# EAGLE design lpc134x (EAGLE 6.4)
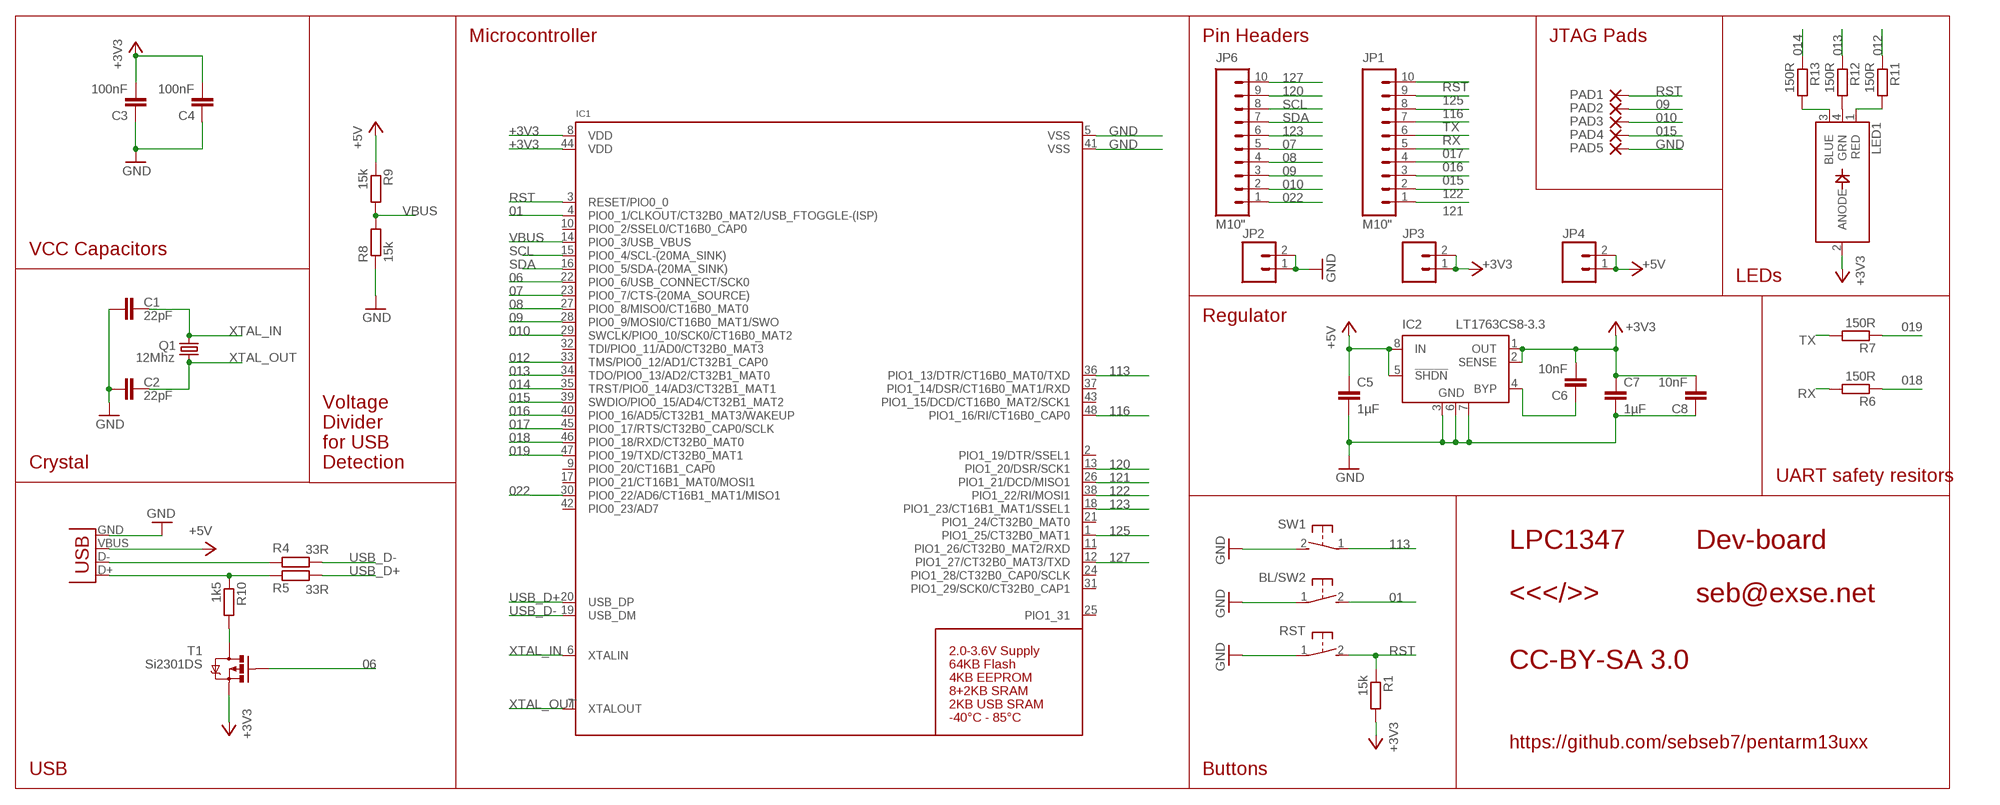
[diagram p0: schematic, sheet 1]

## Parts
BL/SW2  SWITCH_MCTAEF  [SWITCH_MCTAEF]
C1  22pF  C-EUC0402  [C0402]
C2  22pF  C-EUC0402  [C0402]
C3  100nF  C-EUC0402  [C0402]
C4  100nF  C-EUC0402  [C0402]
C5  1µF  CAP0805  [0805]
C6  10nF  C-EUC0402  [C0402]
C7  1µF  CAP0805  [0805]
C8  10nF  C-EUC0402  [C0402]
IC1  LPC1347_QFP48  [LQFP48]
IC2  LT1763CS8-3.3  [SOIC8]
JP1  M10"  [1X10]
JP2  M02PTH  [1X02]
JP3  M02PTH  [1X02]
JP4  M02PTH  [1X02]
JP6  M10"  [1X10]
LED1  LED_RGB_PLCC4  [RGBLED_PLCC4]
PAD1  WIREPADSMD1,27-254  [SMD1,27-2,54]
PAD2  WIREPADSMD1,27-254  [SMD1,27-2,54]
PAD3  WIREPADSMD1,27-254  [SMD1,27-2,54]
PAD4  WIREPADSMD1,27-254  [SMD1,27-2,54]
PAD5  WIREPADSMD1,27-254  [SMD1,27-2,54]
Q1  12Mhz  MT-OSCILLATOR  [MT]
R1  15k  R-EU_R0402  [R0402]
R4  33R  R-EU_R0402  [R0402]
R5  33R  R-EU_R0402  [R0402]
R6  150R  R-EU_R0402  [R0402]
R7  150R  R-EU_R0402  [R0402]
R8  15k  R-EU_R0402  [R0402]
R9  15k  R-EU_R0402  [R0402]
R10  1k5  R-EU_R0402  [R0402]
R11  150R  R-EU_R0402  [R0402]
R12  150R  R-EU_R0402  [R0402]
R13  150R  R-EU_R0402  [R0402]
RST  SWITCH_MCTAEF  [SWITCH_MCTAEF]
SW1  SWITCH_MCTAEF  [SWITCH_MCTAEF]
T1  Si2301DS  MOSFET-PCHANNEL  [SOT23]
X2  USB-SMD-NS  [USB-MINIB-NOSTOP]

## Nets
01: BL/SW2.2 IC1.4(PIO0_1/CLKOUT/CT32B0_MAT2/USB_FTOGGLE-(ISP))
06: IC1.22(PIO0_6/USB_CONNECT/SCK0) T1.1(G)
07: IC1.23(PIO0_7/CTS-(20MA_SOURCE)) JP6.5
08: IC1.27(PIO0_8/MISO0/CT16B0_MAT0) JP6.4
09: IC1.28(PIO0_9/MOSI0/CT16B0_MAT1/SWO) JP6.3 PAD2.1(P)
010: IC1.29(SWCLK/PIO0_10/SCK0/CT16B0_MAT2) JP6.2 PAD3.1(P)
012: IC1.33(TMS/PIO0_12/AD1/CT32B1_CAP0) R11.1
013: IC1.34(TDO/PIO0_13/AD2/CT32B1_MAT0) R12.1
014: IC1.35(TRST/PIO0_14/AD3/CT32B1_MAT1) R13.1
015: IC1.39(SWDIO/PIO0_15/AD4/CT32B1_MAT2) JP1.3 PAD4.1(P)
016: IC1.40(PIO0_16/AD5/CT32B1_MAT3/WAKEUP) JP1.4
017: IC1.45(PIO0_17/RTS/CT32B0_CAP0/SCLK) JP1.5
018: IC1.46(PIO0_18/RXD/CT32B0_MAT0) R6.1
019: IC1.47(PIO0_19/TXD/CT32B0_MAT1) R7.1
022: IC1.30(PIO0_22/AD6/CT16B1_MAT1/MISO1) JP6.1
113: IC1.36(PIO1_13/DTR/CT16B0_MAT0/TXD) SW1.1
116: IC1.48(PIO1_16/RI/CT16B0_CAP0) JP1.8
120: IC1.13(PIO1_20/DSR/SCK1) JP6.9
121: IC1.26(PIO1_21/DCD/MISO1) JP1.1
122: IC1.38(PIO1_22/RI/MOSI1) JP1.2
123: IC1.18(PIO1_23/CT16B1_MAT1/SSEL1) JP6.6
125: IC1.1(PIO1_25/CT32B0_MAT1) JP1.9
127: IC1.12(PIO1_27/CT32B0_MAT3/TXD) JP6.10
+3V3: C3.2 C4.2 C6.2 C7.1 C8.2 IC1.8(VDD) IC1.44(VDD) IC2.1(OUT) IC2.2(SENSE) JP3.1 JP3.2 LED1.2(ANODE) R1.2 T1.2(S)
+5V: C5.1 IC2.5(!SHDN) IC2.8(IN) JP4.1 JP4.2 R9.1 X2.VBUS
GND: BL/SW2.1 C1.1 C2.1 C3.1 C4.1 C5.2 C7.2 C8.1 IC1.5(VSS) IC1.41(VSS) IC2.3(GND) IC2.6(GND) IC2.7(GND) JP2.1 JP2.2 PAD5.1(P) R8.1 RST.1 SW1.2 X2.GND
N$1: LED1.1(RED) R11.2
N$2: LED1.4(GRN) R12.2
N$3: LED1.3(BLUE) R13.2
N$10: R5.2 R10.1 X2.D+
N$11: R4.2 X2.D-
N$13: C6.1 IC2.4(BYP)
N$20: R10.2 T1.3(D)
RST: IC1.3(RESET/PIO0_0) JP1.10 PAD1.1(P) R1.1 RST.2
RX: JP1.6 R6.2
SCL: IC1.15(PIO0_4/SCL-(20MA_SINK)) JP6.8
SDA: IC1.16(PIO0_5/SDA-(20MA_SINK)) JP6.7
TX: JP1.7 R7.2
USB_D+: IC1.20(USB_DP) R5.1
USB_D-: IC1.19(USB_DM) R4.1
VBUS: IC1.14(PIO0_3/USB_VBUS) R8.2 R9.2
XTAL_IN: C1.2 IC1.6(XTALIN) Q1.3
XTAL_OUT: C2.2 IC1.7(XTALOUT) Q1.1
Unconnected: IC1.2(PIO1_19/DTR/SSEL1) IC1.9(PIO0_20/CT16B1_CAP0) IC1.10(PIO0_2/SSEL0/CT16B0_CAP0) IC1.11(PIO1_26/CT32B0_MAT2/RXD) IC1.17(PIO0_21/CT16B1_MAT0/MOSI1) IC1.21(PIO1_24/CT32B0_MAT0) IC1.24(PIO1_28/CT32B0_CAP0/SCLK) IC1.25(PIO1_31) IC1.31(PIO1_29/SCK0/CT32B0_CAP1) IC1.32(TDI/PIO0_11/AD0/CT32B0_MAT3) IC1.37(PIO1_14/DSR/CT16B0_MAT1/RXD) IC1.42(PIO0_23/AD7) IC1.43(PIO1_15/DCD/CT16B0_MAT2/SCK1)

## Notes on the sheet
- Microcontroller | Pin Headers | JTAG Pads
- VCC Capacitors
- LEDs
- Regulator
- Crystal
- Voltage
  Divider
  for USB
  Detection
- UART safety resitors
- LPC1347 | Dev-board
- <<</>> | seb@exse.net
- CC-BY-SA 3.0
- https://github.com/sebseb7/pentarm13uxx
- USB | Buttons

## Library data of the parts
BL/SW2 RST SW1 = seb:SWITCH_MCTAEF
C1-C4 C6 C8 = rcl:C-EU: CAPACITOR, European symbol
C5 C7 = SparkFun:CAP: Capacitor Standard 0603 ceramic capacitor, and 0.1" leaded capacitor.
IC1 = microbuilder:LPC1347_QFP48: LPC1347 - ARM Cortex M3 72MHz MCU Supply: 2.0-3.6V 12-bit 500kHz ADC Flash: 64KB EEPROM: 4KB SRAM: 8KB SRAM0 + 2KB SRAM1 + 2KB USB Temp: -40°C - 85°C
IC2 = linear-technology:LT1763CS8: 500mA, Low Noise, LDO Micropower Regulators Source: http://cds.linear.com/docs/Datasheet/1763ff.pdf
JP1 JP6 = SparkFun-Connectors:M10: Header 10 Standard 10-pin 0.1" header. Use with straight break away headers (SKU : PRT-00116), right angle break away headers (PRT-00553), swiss pins (PRT-00743), machine pins (PRT-00117), and female headers (PRT-00115).
JP2-JP4 = SparkFun-Connectors:M02: Header 2 Standard 2-pin 0.1" header. Use with straight break away headers (SKU : PRT-00116), right angle break away headers (PRT-00553), swiss pins (PRT-00743), machine pins (PRT-00117), and female headers (PRT-00115). Molex polarized connector foot print use with SKU : PRT-08233 with associated crimp pins and housings.
LED1 = microbuilder:LED_RGB_PLCC4: RGB LED - PLCC4 Cree 20mA Common Anode Digikey: CLV1A-FKB-CJ1M1F1BB7R4S3CT-ND Red: 2.6V Vf, 550mcd Green: 3.2V Vf, 850mcd Blue: 3.2V Vf, 320mcd
PAD1-PAD5 = wirepad:WIREPAD: Wire PAD connect wire on PCB
Q1 = seb:MT-OSCILLATOR
R1 R4-R13 = rcl:R-EU_: RESISTOR, European symbol
T1 = SparkFun:MOSFET-PCHANNEL
X2 = SparkFun-Connectors:USB: USB Connectors USB-B-PTH is fully proven SKU : PRT-00139 USB-miniB is fully proven SKU : PRT-00587 USB-A-PCB is untested. USB-A-H is throughly reviewed, but untested. Spark Fun Electronics SKU : PRT-00437 USB-B-SMT is throughly reviewed, but untested. Needs silkscreen touching up. USB-A-S has not been used/tested USB-MB-H has not been used/tested

## Board
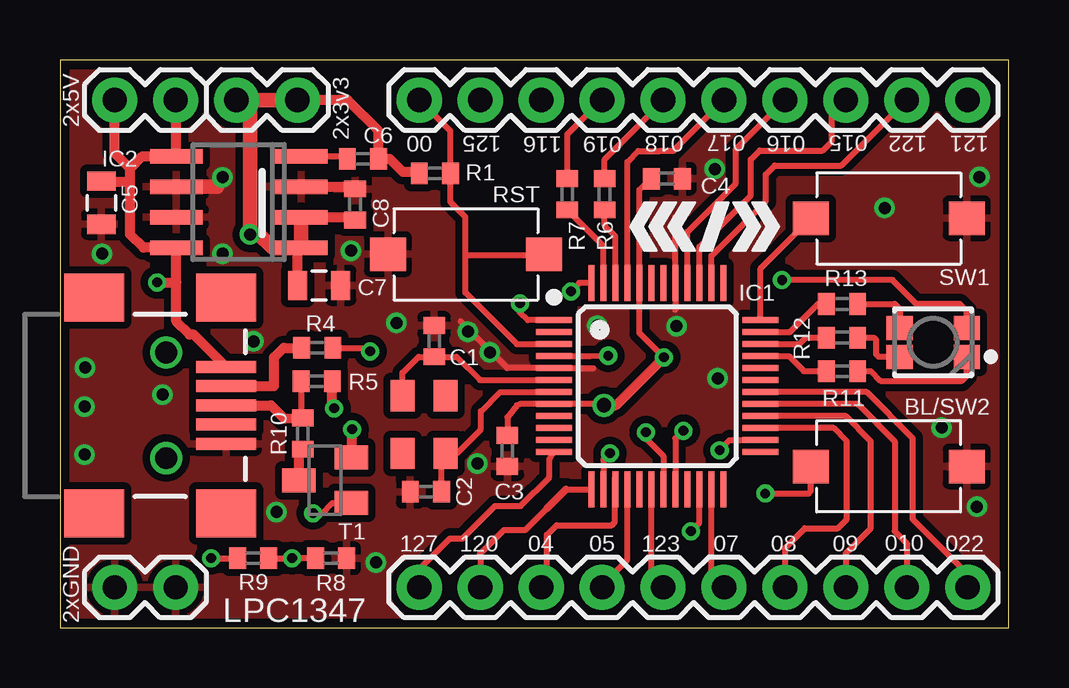
[diagram p1: board, top side]
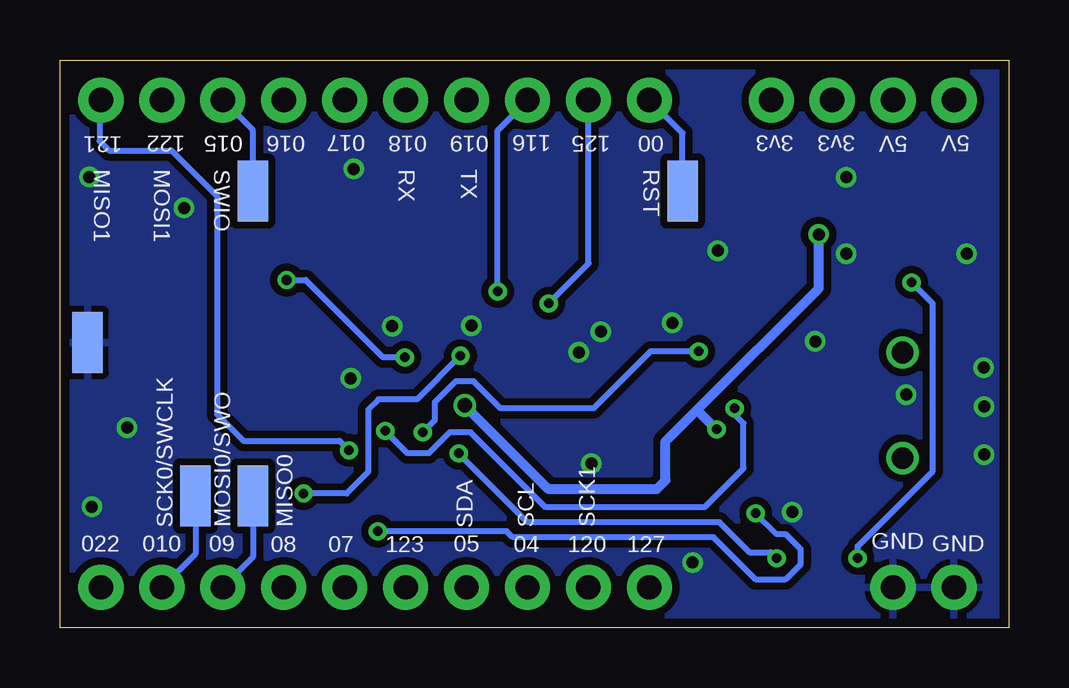
[diagram p2: board, bottom side, seen from below]

Size 39.55 x 23.68 mm. Coordinates in mm from the lower left corner, seen from the top.
Outline: 0,0 39.55,0 39.55,23.68 0,23.68 0,0
Copper layers (1*16): Top 0.0356mm / dielectric 1.5011mm / Bottom 0.0356mm
Design rules "LaenPCBOrder": minimum track width 6mil, minimum drill 13mil, track to track 6mil, track to pad 6mil, pad to pad 6mil, via to via 6mil, smd to smd 6mil, copper to edge 15mil, drill to drill 6mil, minimum pad ring 7mil, minimum via ring 7mil, stop-mask expansion 4mil, vias tented up to drill 0mil, thermal gap 10mil

### Footprints (pad centres in the part's own frame; a part is rotated, then mirrored left to right if it is on the bottom)
SWITCH_MCTAEF = smd 1.5 x 1.4: 1 -3.25,0; 2 3.25,0
C0402 = smd 0.7 x 0.9: 1 -0.65,0; 2 0.65,0
0805 = smd 0.8 x 1.2: 1 -0.9,0; 2 0.9,0
LQFP48 = smd 1.5 x 0.25: 1 -4.3,2.75; 2 -4.3,2.25; 3 -4.3,1.75; 4 -4.3,1.25; 5 -4.3,0.75; 6 -4.3,0.25; 7 -4.3,-0.25; 8 -4.3,-0.75; 9 -4.3,-1.25; 10 -4.3,-1.75; 11 -4.3,-2.25; 12 -4.3,-2.75; 25 4.3,-2.75; 26 4.3,-2.25; 27 4.3,-1.75; 28 4.3,-1.25; 29 4.3,-0.75; 30 4.3,-0.25; 31 4.3,0.25; 32 4.3,0.75; 33 4.3,1.25; 34 4.3,1.75; 35 4.3,2.25; 36 4.3,2.75 | smd 0.25 x 1.5: 13 -2.75,-4.3; 14 -2.25,-4.3; 15 -1.75,-4.3; 16 -1.25,-4.3; 17 -0.75,-4.3; 18 -0.25,-4.3; 19 0.25,-4.3; 20 0.75,-4.3; 21 1.25,-4.3; 22 1.75,-4.3; 23 2.25,-4.3; 24 2.75,-4.3; 37 2.75,4.3; 38 2.25,4.3; 39 1.75,4.3; 40 1.25,4.3; 41 0.75,4.3; 42 0.25,4.3; 43 -0.25,4.3; 44 -0.75,4.3; 45 -1.25,4.3; 46 -1.75,4.3; 47 -2.25,4.3; 48 -2.75,4.3
SOIC8 = smd 0.6 x 2.2: 1 -1.905,-2.6; 2 -0.635,-2.6; 3 0.635,-2.6; 4 1.905,-2.6; 5 1.905,2.6; 6 0.635,2.6; 7 -0.635,2.6; 8 -1.905,2.6
1X10 = drill 1.016 pad 1.88: 1 0,0; 2 2.54,0; 3 5.08,0; 4 7.62,0; 5 10.16,0; 6 12.7,0; 7 15.24,0; 8 17.78,0; 9 20.32,0; 10 22.86,0
1X02 = drill 1.016 pad 1.88: 1 0,0; 2 2.54,0
RGBLED_PLCC4 = smd 1.1 x 1: 1 -1.4,0.6; 2 -1.4,-0.6; 3 1.4,-0.6; 4 1.4,0.6
SMD1,27-2,54 = smd 1.27 x 2.54: 1 0,0
MT = smd 1.3 x 1: 1 1.2,0.9; 2 -1.2,0.9; 3 -1.2,-0.9; 4 1.2,-0.9
R0402 = smd 0.7 x 0.9: 1 -0.65,0; 2 0.65,0
SOT23 = smd 1 x 1.4: 1 -0.95,-1.1; 2 0.95,-1.1; 3 0,1.1
USB-MINIB-NOSTOP = smd 2.5 x 0.5: D+ 2.5,0; D- 2.5,0.8; GND 2.5,-1.6; ID 2.5,-0.8; VBUS 2.5,1.6 | smd 2.5 x 2: G1 -3,-4.5; G2 -3,4.5; G3 2.5,4.5; G4 2.5,-4.5 | drill 0.9 pad 0.8: H1 0,2.2 | drill 0.9 pad 0.787: H2 0,-2.2

### Placement (x,y rotation side)
BL/SW2  34.55,6.72 180 top
C1  15.6,11.95 270 top
C2  15.25,5.67 0 top
C3  18.65,7.38 90 top
C4  25.3,18.73 180 top
C5  1.73,17.73 270 top
C6  12.62,19.55 0 top
C7  10.8,14.28 0 top
C8  12.3,17.65 270 top
IC1  24.9,10.07 0 top
IC2  7.45,17.75 90 top
JP1  37.84,22.01 180 top
JP2  2.28,1.69 0 top
JP3  7.36,22.01 0 top
JP4  2.28,22.01 0 top
JP6  37.84,1.69 180 top
LED1  36.4,11.9 180 top
PAD1  13.6,18.2 180 bottom
PAD2  31.5,5.5 180 bottom
PAD3  33.9,5.5 0 bottom
PAD4  31.5,18.2 0 bottom
PAD5  38.4,11.9 180 bottom
Q1  15.18,8.47 270 top
R1  15.62,18.95 180 top
R4  10.72,11.68 180 top
R5  10.7,10.28 180 top
R6  22.7,18.07 90 top
R7  21.15,18.07 90 top
R8  11.3,2.9 180 top
R9  8.05,2.9 0 top
R10  10.12,8.1 270 top
R11  32.6,10.7 0 top
R12  32.6,12.1 0 top
R13  32.6,13.5 0 top
RST  16.93,15.57 0 top
SW1  34.55,17.07 0 top
T1  11.05,6.15 90 top
U$2  [C3D2_LOGO_SMALL]  23.77,16.72 0 top
X2  4.42,9.28 0 top

### Tracks (layer width: path | path; a pad name or v marks a point on that pad's centre or on a via)
01  (via drill 0.4)
  Top 0.254: IC1.4 22.1,11.32 v22.86,11.34 | 31.27,6.7 BL/SW2.2 31.3,5.7 31.2,5.6 v29.4,5.6
  Bottom 0.254: v29.4,5.6 27.6,5.6 26.7,6.5 26.7,9.1 26.27,9.53 24.67,9.53 v22.86,11.34
06  (via drill 0.4)
  Top 0.254: IC1.22 26.65,4.38 v26.3,4.03 | 11.97,5.15 T1.1 11.35,5.2 10.93,4.78 v10.55,4.78
  Bottom 0.254: v26.3,4.03 20.93,4.03 20.68,3.77 12.3,3.77 10.55,2.02 9.3,2.02 8.68,2.65 8.68,3.27 9.3,3.9 9.68,3.9 v10.55,4.78
07
  Top 0.254: IC1.23 27.15,2.33 27.13,2.31 27.68,2.31 JP6.5
08
  Top 0.254: IC1.27 32.25,8.32 32.8,7.78 32.8,4.53 32.42,4.15 31.05,4.15 30.21,3.31 30.22,3.31 JP6.4
09
  Top 0.254: IC1.28 32.75,8.82 33.8,7.78 33.8,4.15 32.75,3.1 32.76,3.1 JP6.3
  Bottom 0.254: PAD2.1 31.5,2.95 JP6.3
010
  Top 0.254: IC1.29 33.25,9.32 34.8,7.78 34.8,4.03 35.29,3.54 35.3,3.54 JP6.2
  Bottom 0.254: PAD3.1 33.9,3.09 JP6.2
012
  Top 0.254: IC1.33 30.38,11.32 31,10.7 R11.1
013
  Top 0.254: 32.12,11.82 R12.1 31.1,12.1 30.82,11.82 IC1.34
014
  Top 0.254: IC1.35 30.43,12.32 31.6,13.5 R13.1
015
  Top 0.254: IC1.39 26.65,15.88 28.8,18.02 28.8,19.52 29.18,19.9 31.8,19.9 32.17,20.27 32.17,21.41 32.76,22 JP1.3
  Bottom 0.254: 32.7,21.95 JP1.3 31.5,20.75 PAD4.1
016
  Top 0.254: IC1.40 26.15,16.5 28.18,18.52 28.18,19.95 30.22,22 JP1.4
017
  Top 0.254: IC1.45 23.65,19.43 24.1,19.88 25,19.88 25.02,19.89 25.57,19.89 27.68,22 JP1.5
018
  Top 0.254: IC1.46 23.15,16.32 22.7,16.77 R6.1
019
  Top 0.254: IC1.47 22.65,15.93 R7.1
022
  Top 0.254: IC1.30 33.62,9.82 35.55,7.9 35.55,4.53 37.83,2.25 37.84,2.25 JP6.1
113
  Top 0.254: IC1.36 29.2,14.97 SW1.1
116  (via drill 0.4)
  Top 0.254: IC1.48 21.65,14.38 v21.3,14.03
  Bottom 0.254: v21.3,14.03 21.3,20.73 20.06,21.97 JP1.8
120
  Top 0.254: 20.3,4.97 19.4,4.08 18.5,4.08 17.51,3.08 17.52,3.07 JP6.9 | 21.1,5.78 IC1.13
  Top 0.305: 20.3,4.97 21.1,5.78
121  (via drill 0.4)
  Top 0.254: v27.5,7.4 27.93,7.83 IC1.26
  Bottom 0.254: JP1.1 37.9,21.95 37.9,20.3 37.5,19.9 34.9,19.9 33,18 33,8.9 31.9,7.8 27.9,7.8 v27.5,7.4 v27.5,7.41
122
  Top 0.254: IC1.38 27.15,15.5 29.43,17.77 29.43,18.9 29.8,19.27 32.58,19.27 35.3,22 JP1.2
123
  Top 0.254: IC1.18 24.65,2.15 25.14,2.15 JP6.6
125  (via drill 0.4)
  Top 0.254: IC1.1 19.5,12.82 19.18,13.15 v19.18,13.53
  Bottom 0.254: v19.18,13.53 17.51,15.19 17.52,15.2 JP1.9
127
  Top 0.254: IC1.12 20.4,7.03 20.4,6.28 19.2,5.08 18.12,5.08 16.77,3.73 16.25,3.73 14.97,2.44 14.98,2.43 JP6.10
+3V3  (via drill 0.4, 0.5, 0.6)
  Top 0.254: C3.2 18.65,8.78 19.05,9.28 19.18,9.32 IC1.8 22.62,9.32 v22.68,9.28 22.65,9.25 | C4.2 24.15,18.25 IC1.44 24.15,12.3 v25.18,11.28 | LED1.2 37.8,13.2 37.5,13.5 35.7,13.5 34.7,14.5 v30.1,14.5
  Top 0.406: v22.68,9.28 23.18,9.28 v25.18,11.28 | T1.2 12.15,8.18 v12.18,8.28 | 9.43,15.72 9.55,15.85 | IC2.2 12.19,17.11 C8.2 | C7.1 9.9,15.7 IC2.1 | JP3.2 11.99,22.01 13.28,20.73 C6.2 13.75,19.55 14.3,19 14.93,19 R1.2
  Top 0.61: IC2.2 IC2.1 9.55,15.85 8.86,15.85 8.3,16.4 v7.92,16.4 7.92,21.5 7.42,22.01 JP3.1 JP3.2
  Bottom 0.254: v22.68,9.28 22.55,9.28 | v25.18,11.28 26.07,11.28 29.3,14.5 v30.1,14.5
  Bottom 0.406: v22.68,9.28 19.18,5.78 14.68,5.78 14.3,6.15 14.3,7.78 12.93,9.15 | 12.93,9.15 7.92,14.15 v7.92,16.4 | v12.18,8.28 12.93,9.03 12.93,9.15
+5V  (via drill 0.4)
  Top 0.254: v6.3,2.9 R9.1 | 4.85,22 4.84,22.01 JP4.2
  Top 0.406: 2.92,19.15 3.43,19.66 IC2.5 4.85,22 | 2.92,18.57 2.92,16.4 3.48,15.85 IC2.8 4.85,14.4 | 2.92,18.57 2.92,19.15 | C5.1 1.7,18.57 2.92,18.57 | 2.92,19.15 2.28,19.8 JP4.1 | X2.VBUS 5.58,12.22 5.4,12.22 4.85,12.77 4.85,14.4 | v4.05,14.4 4.85,14.4
  Bottom 0.254: v4.05,14.4 3.17,13.53 3.17,6.53 6.3,3.4 v6.3,2.9
GND  (via drill 0.5)
  Top 0.254: 25.9,17.38 25.65,17.12 IC1.41 25.65,13.25 | 16.7,12.78 18.65,10.82 IC1.5 22.23,10.82
  Top 0.406: IC2.3 12.21,18.39 C8.1
  Top 0.61: IC2.6 6.55,18.39
  other vias: 36.75,8.35 38.23,5.05 38.33,18.8 34.38,17.5 27.43,10.4 14.03,12.71 27.3,19.12 25.7,12.57 12.13,15.72 1.75,15.6 17.92,11.48 17,12.35 6.78,15.6 22.4,12.6 1.02,9.22 4.28,9.72 17.4,6.85 6.78,18.78 13.18,2.73 1.02,7.22 9.03,4.82 1.05,10.85 8.07,11.94
  pour Top (isolate 0.305): -0.55,-0.1 39.35,-0.23 39.55,23.82 -0.35,23.95
  pour Bottom (isolate 0.305): -0.57,-0.1 39.35,-0.23 39.45,23.73 -0.47,23.85
N$1
  Top 0.254: R11.2 33.8,10.7 34.2,10.3 37.6,10.3 37.8,10.5 LED1.1
N$2
  Top 0.254: R12.2 33.92,12.1 34.02,12 34.02,11.4 34.12,11.3 LED1.4
N$3
  Top 0.254: R13.2 34.8,13.5 35,13.3 LED1.3
N$10
  Top 0.254: 9.95,8.88 R10.1 10.05,8.75 R5.2
  Top 0.406: X2.D+ 8.8,9.28 9.35,8.72 R10.1
N$11
  Top 0.406: X2.D- 8.93,10.07 8.93,11.28 9.32,11.68 R4.2
N$13
  Top 0.254: IC2.4 12.08,19.66 C6.1
N$20
  Top 0.406: R10.2 9.95,7.28 T1.3
RST
  Top 0.254: 16.9,15.53 16.9,13.97 19.05,11.82 IC1.3 | 16.9,15.53 16.9,17.12 16.27,17.75 R1.1 16.27,20.71 JP1.10 | RST.2 19.73,15.57 19.68,15.53 16.9,15.53
  Bottom 0.254: 14.9,21.93 JP1.10 13.6,20.62 PAD1.1
RX
  Top 0.254: R6.2 22.7,19.52 25.14,21.97 JP1.6
SCL
  Top 0.254: IC1.15 23.13,6.25 23.13,4.41 23,4.28 20.7,4.28 20.3,3.88 20.3,2.02 20.06,1.79 JP6.8
SDA
  Top 0.254: IC1.16 23.65,2.83 22.6,1.79 JP6.7
TX
  Top 0.254: R7.2 21.15,20.57 22.58,22.01 JP1.7
USB_D+  (via drill 0.4)
  Top 0.254: IC1.20 25.65,7.9 v25.99,8.21
  Top 0.406: v11.43,9.15 11.35,9.22 R5.1
  Bottom 0.254: 25.68,7.9 v25.99,8.21 25.05,7.28 24.18,7.28 23.3,8.15 22.43,8.15 19.3,5.03 12.68,5.03 11.05,6.65 11.05,8.53 11.43,8.9 v11.43,9.15
USB_D-  (via drill 0.4)
  Top 0.254: v24.43,8.15 24.43,7.9 25.15,7.17 IC1.19 | R4.1 12.7,11.68 v12.93,11.53
  Bottom 0.254: v24.43,8.15 23.93,8.65 23.93,9.4 23.05,10.28 22.3,10.28 21.18,9.15 17.3,9.15 14.93,11.53 v12.93,11.53
VBUS  (via drill 0.4)
  Top 0.254: v22.93,7.28 22.65,7 IC1.14 | R8.2 v9.68,2.9 R9.2
  Bottom 0.254: v22.93,7.28 20.05,4.4 12.05,4.4 10.8,3.15 9.93,3.15 v9.68,2.9
XTAL_IN
  Top 0.254: IC1.6 17.5,10.32 16.52,11.3 C1.2 14.95,11.3 14.28,10.62 Q1.3
XTAL_OUT
  Top 0.254: IC1.7 18.35,9.82 17.55,9.03 17.55,8.28 16.55,7.28 Q1.1 15.9,6.97 C2.2

### Text on the board
tNames: 2x5V | 00 | 125 | 116 | 019 | 018 | 017 | 016 | 015 | 122 | 121 | 2x3v3 | 127 | 120 | 04 | 05 | 123 | 07 | 08 | 09 | 010 | 022 | 2xGND | LPC1347
bNames: 5V | 5V | 3v3 | 3v3 | 00 | 125 | 116 | 019 | 018 | 017 | 016 | 015 | 122 | 121 | RST | TX | RX | SWIO | MOSI1 | MISO1 | SCK1 | SCL | SDA | MISO0 | MOSI0/SWO | SCK0/SWCLK | GND | GND | 127 | 120 | 04 | 05 | 123 | 07 | 08 | 09 | 010 | 022
tValues: LPC1347 | 12Mhz
bStop: seb@exse.net